# Altium project TARS-Base.PrjPcb
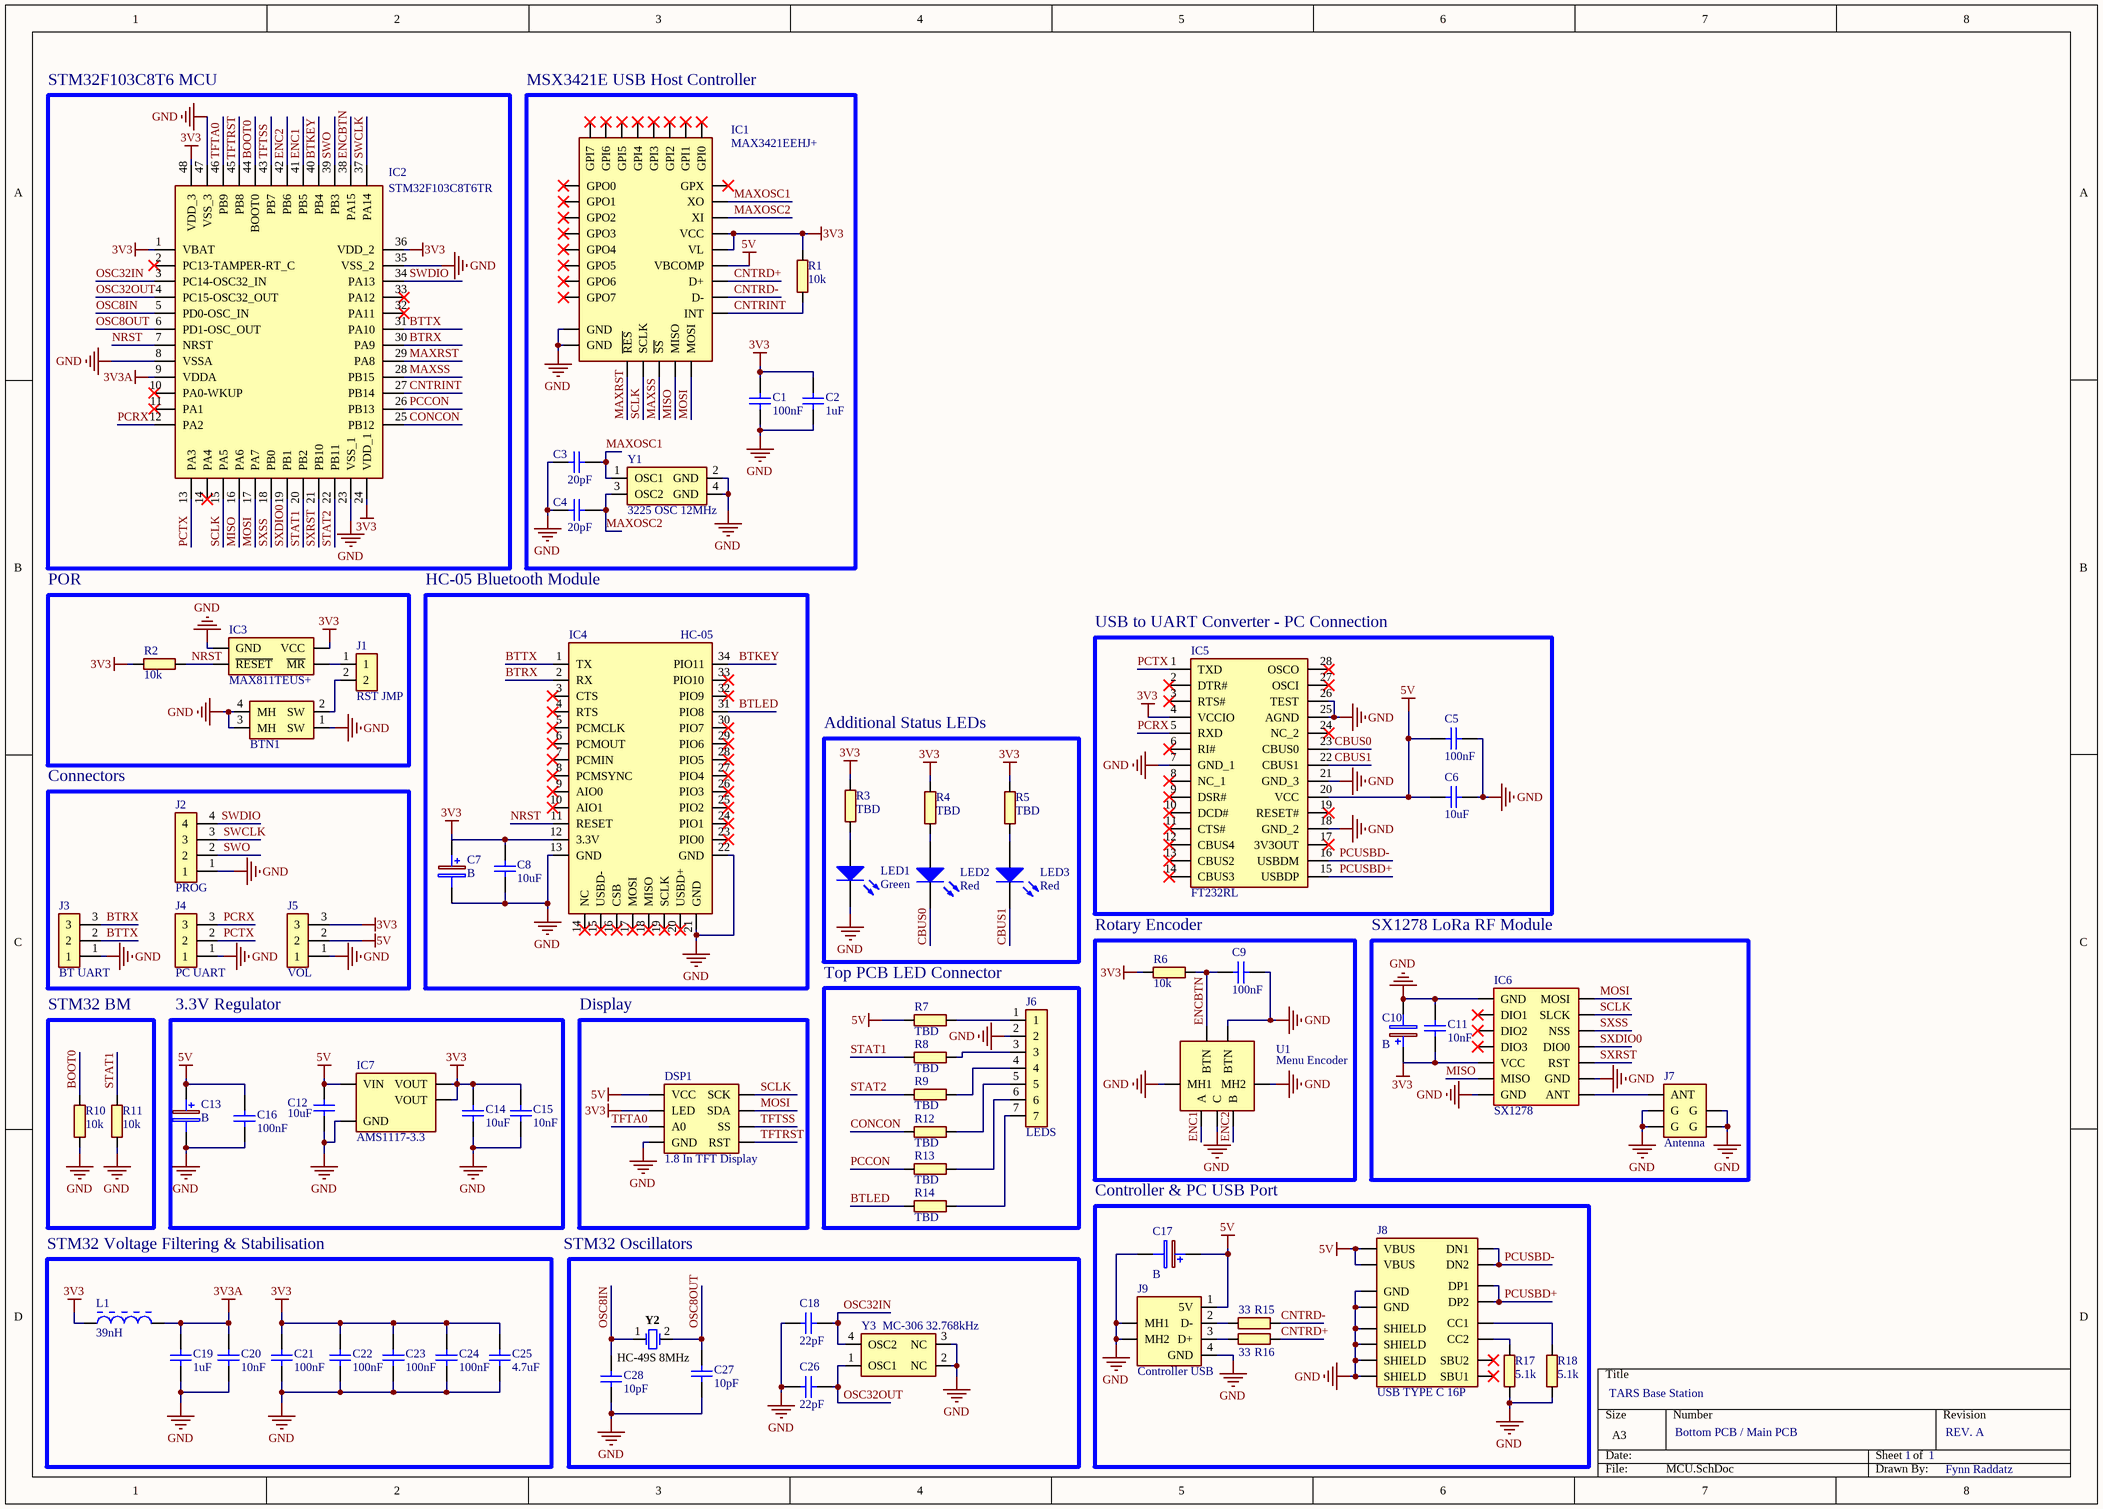
[diagram p0: MCU.SchDoc]
1 sheet, 72 parts. Net scope: global (net labels, ports and power ports of the same name join across sheets).
Board file: PCB1.PcbDoc

## Sheet MCU.SchDoc
size A3; SheetNumber: 1; SheetTotal: 1

### Parts
BTN1  SMD Button 6x6mm Angled  [SMD Button 6x6 Angled]  (value not drawn)
C1  100nF  [CAPC2012 METRIC]
C2  1uF  [CAPC2012 METRIC]
C3  20pF  [CAPC2012 METRIC]
C4  20pF  [CAPC2012 METRIC]
C5  100nF  [CAPC2012 METRIC]
C6  10uF  [CAPC2012 METRIC]
C7  B  [Tantal-B-1210]
C8  10uF  [CAPC2012 METRIC]
C9  100nF  [CAPC2012 METRIC]
C10  B  [Tantal-B-1210]
C11  10nF  [CAPC2012 METRIC]
C12  10uF  [CAPC2012 METRIC]
C13  B  [Tantal-B-1210]
C14  10uF  [CAPC2012 METRIC]
C15  10nF  [CAPC2012 METRIC]
C16  100nF  [CAPC2012 METRIC]
C17  B  [Tantal-B-1210]
C18  22pF  [CAPC2012 METRIC]
C19  1uF  [CAPC2012 METRIC]
C20  10nF  [CAPC2012 METRIC]
C21  100nF  [CAPC2012 METRIC]
C22  100nF  [CAPC2012 METRIC]
C23  100nF  [CAPC2012 METRIC]
C24  100nF  [CAPC2012 METRIC]
C25  4.7uF  [CAPC2012 METRIC]
C26  22pF  [CAPC2012 METRIC]
C27  10pF  [CAPC2012 METRIC]
C28  10pF  [CAPC2012 METRIC]
DSP1  1.8 In TFT Display  [1.8 Inch TFT Display]
IC1  MAX3421EEHJ+  [QFP50P700X700X120-32N]
IC2  STM32F103C8T6TR  [QFP50P900X900X160-48N]
IC3  MAX811TEUS+  [MAX811REUST]
IC4  HC-05  [HC-05]
IC5  FT232RL  [SOP65P778X200-28N]
IC6  SX1278  [SX1278]
IC7  AMS1117-3.3  [SOT229P700X180-4N]
J1  RST JMP  [HDRV2W110P0X254_1X2_508X254X854P]
J2  PROG  [HDRV4W95P0X254_1X4_1016X254X854P]
J3  BT UART  [HDRV3W64P0X254_1X3_762X254X869P]
J4  PC UART  [HDRV3W64P0X254_1X3_762X254X869P]
J5  VOL  [HDRV3W64P0X254_1X3_762X254X869P]
J6  LEDS  [HDRV7W64P0X254_1X7_1778X254X869P]
J7  Antenna  [PCBRPSMAFRAHT]
J8  USB TYPE C 16P  [USB TYPE C 16P]
J9  Controller USB  [875200010BLF]
L1  39nH  [LIRD-LI0805H151R-10-2_V]
LED1  Green  [1206_A]
LED2  Red  [1206_A]
LED3  Red  [1206_A]
R1  10k  [RESC2012X65N]
R2  10k  [RESC2012X65N]
R3  TBD  [RESC2012X65N]
R4  TBD  [RESC2012X65N]
R5  TBD  [RESC2012X65N]
R6  10k  [RESC2012X65N]
R7  TBD  [RESC2012X65N]
R8  TBD  [RESC2012X65N]
R9  TBD  [RESC2012X65N]
R10  10k  [RESC2012X65N]
R11  10k  [RESC2012X65N]
R12  TBD  [RESC2012X65N]
R13  TBD  [RESC2012X65N]
R14  TBD  [RESC2012X65N]
R15  33  [RESC2012X65N]
R16  33  [RESC2012X65N]
R17  5.1k  [RESC2012X65N]
R18  5.1k  [RESC2012X65N]
U1  Menu Encoder  [EC11B152442D]
Y1  3225 OSC 12MHz  [TSX3225240000MF20GAC0]
Y2  HC-49S 8MHz  [FOX-HC49SDLF_V]
Y3  MC-306 32.768kHz  [MC306327680KA3ROHS]

### Blocks framed on the sheet
STM32F103C8T6 MCU: IC2
MSX3421E USB Host Controller: C1-C4 IC1 R1 Y1
POR: BTN1 IC3 J1 R2
HC-05 Bluetooth Module: C7 C8 IC4
USB to UART Converter - PC Connection: C5 C6 IC5
Additional Status LEDs: LED1-LED3 R3-R5
Connectors: J2-J5
Top PCB LED Connector: J6 R7-R9 R12-R14
Rotary Encoder: C9 R6 U1
SX1278 LoRa RF Module: C10 C11 IC6 J7
STM32 BM: R10 R11
3.3V Regulator: C12-C16 IC7
Display: DSP1
Controller & PC USB Port: C17 J8 J9 R15-R18
STM32 Voltage Filtering & Stabilisation: C19-C25 L1

### Nets
3V3: C1.1 C2.1 C7.1(+) C8.1 C10.1(+) C11.2 C14.1 C15.1 C21.2 C22.2 C23.2 C24.2 C25.2 DSP1.1(LED) IC1.2(VL) IC1.23(VCC) IC2.1(VBAT) IC2.24(VDD_1) IC2.36(VDD_2) IC2.48(VDD_3) IC3.4(VCC) IC4.12(3.3V) IC5.4(VCCIO) IC6.5(VCC) IC7.2(VOUT) IC7.4(VOUT) J5.3 L1.1 R1.2 R2.2 R3.2 R4.2 R5.2 R6.2
3V3A: C19.2 C20.2 IC2.9(VDDA) L1.2
5V: C5.1 C6.1 C12.1 C13.1(+) C16.2 C17.1(+) DSP1.8(VCC) IC1.22(VBCOMP) IC5.20(VCC) IC7.3(VIN) J5.2 J8.A4B9(VBUS) J8.B4A9(VBUS) J9.1(5V) R7.2
GND: BTN1.1(SW) BTN1.3(MH) BTN1.4(MH) C1.2 C2.2 C3.2 C4.2 C5.2 C6.2 C7.2(-) C8.2 C9.2 C10.2(-) C11.1 C12.2 C13.2(-) C14.2 C15.2 C16.1 C17.2(-) C18.2 C19.1 C20.1 C21.1 C22.1 C23.1 C24.1 C25.1 C26.2 C27.1 C28.1 DSP1.7(GND) IC1.3(GND) IC1.19(GND) IC2.8(VSSA) IC2.23(VSS_1) IC2.35(VSS_2) IC2.47(VSS_3) IC3.1(GND) IC4.13(GND) IC4.21(GND) IC4.22(GND) IC5.7(GND_1) IC5.18(GND_2) IC5.21(GND_3) IC5.25(AGND) IC5.26(TEST) IC6.1(GND) IC6.12(GND) IC6.14(GND) IC7.1(GND) J2.1 J3.1 J4.1 J5.1 J6.2 J7.2(G) J7.3(G) J7.4(G) J7.5(G) J8.A1B12(GND) J8.B1A12(GND) J8.S1(SHIELD) J8.S2(SHIELD) J8.S3(SHIELD) J8.S4(SHIELD) J9.4(GND) J9.MH1 J9.MH2 LED1.1(K) R10.2 R11.2 R17.1 R18.1 U1.C U1.MH1 U1.MH2 U1.MH4(BTN) Y1.2(GND) Y1.4(GND) Y3.2(NC) Y3.3(NC)
BOOT0: IC2.44(BOOT0) R10.1
BTKEY: IC2.40(PB4) IC4.34(PIO11)
BTLED: IC4.31(PIO8) R14.2
BTRX: IC2.30(PA9) IC4.2(RX) J3.3
BTTX: IC2.31(PA10) IC4.1(TX) J3.2
CBUS0: IC5.23(CBUS0) LED2.1(K)
CBUS1: IC5.22(CBUS1) LED3.1(K)
CNTRD+: IC1.21(D+) R16.2
CNTRD-: IC1.20(D-) R15.2
CNTRINT: IC1.18(INT) IC2.27(PB14) R1.1
CONCON: IC2.25(PB12) R12.2
ENC1: IC2.41(PB5) U1.A
ENC2: IC2.42(PB6) U1.B
ENCBTN: C9.1 IC2.38(PA15) R6.1 U1.MH3(BTN)
MAXOSC1: C3.1 IC1.25(XO) Y1.1(OSC1)
MAXOSC2: C4.1 IC1.24(XI) Y1.3(OSC2)
MAXRST: IC1.12(~{RES}) IC2.29(PA8)
MAXSS: IC1.14(~{SS}) IC2.28(PB15)
MISO: IC1.15(MISO) IC2.16(PA6) IC6.6(MISO)
MOSI: DSP1.3(SDA) IC1.16(MOSI) IC2.17(PA7) IC6.7(MOSI)
NRST: IC2.7(NRST) IC3.2(~{RESET}) IC4.11(RESET) R2.1
OSC8IN: C28.2 IC2.5(PD0-OSC_IN) Y2.1
OSC8OUT: C27.2 IC2.6(PD1-OSC_OUT) Y2.2
OSC32IN: C18.1 IC2.3(PC14-OSC32_IN) Y3.4(OSC2)
OSC32OUT: C26.1 IC2.4(PC15-OSC32_OUT) Y3.1(OSC1)
PCCON: IC2.26(PB13) R13.2
PCRX: IC2.12(PA2) IC5.5(RXD) J4.3
PCTX: IC2.13(PA3) IC5.1(TXD) J4.2
PCUSBD+: IC5.15(USBDP) J8.A6(DP1) J8.B6(DP2)
PCUSBD-: IC5.16(USBDM) J8.A7(DN1) J8.B7(DN2)
SCLK: DSP1.2(SCK) IC1.13(SCLK) IC2.15(PA5) IC6.8(SLCK)
STAT1: IC2.20(PB2) R8.2 R11.1
STAT2: IC2.22(PB11) R9.2
SWCLK: IC2.37(PA14) J2.3
SWDIO: IC2.34(PA13) J2.4
SWO: IC2.39(PB3) J2.2
SXDIO0: IC2.19(PB1) IC6.10(DIO0)
SXRST: IC2.21(PB10) IC6.11(RST)
SXSS: IC2.18(PB0) IC6.9(NSS)
TFTA0: DSP1.4(A0) IC2.46(PB9)
TFTRST: DSP1.5(RST) IC2.45(PB8)
TFTSS: DSP1.6(SS) IC2.43(PB7)
NetBTN1_2: BTN1.2(SW) J1.2
NetIC3_3: IC3.3(~{MR}) J1.1
NetIC6_13: IC6.13(ANT) J7.1(ANT)
NetJ6_1: J6.1 R7.1
NetJ6_3: J6.3 R8.1
NetJ6_4: J6.4 R9.1
NetJ6_5: J6.5 R12.1
NetJ6_6: J6.6 R13.1
NetJ6_7: J6.7 R14.1
NetJ8_A5: J8.A5(CC1) R18.2
NetJ8_B5: J8.B5(CC2) R17.2
NetJ9_2: J9.2(D-) R15.1
NetJ9_3: J9.3(D+) R16.1
NetLED1_2: LED1.2(A) R3.1
NetLED2_2: LED2.2(A) R4.1
NetLED3_2: LED3.2(A) R5.1

Not connected (* = marked no-connect by the designer): IC1 1(GPI7)* 4(GPO0)* 5(GPO1)* 6(GPO2)* 7(GPO3)* 8(GPO4)* 9(GPO5)* 10(GPO6)* 11(GPO7)* 17(GPX)* 26(GPI0)* 27(GPI1)* 28(GPI2)* 29(GPI3)* 30(GPI4)* 31(GPI5)* 32(GPI6)*; IC2 2(PC13-TAMPER-RT_C)* 10(PA0-WKUP)* 11(PA1)* 14(PA4)* 32(PA11)* 33(PA12)*; IC4 3(CTS)* 4(RTS)* 5(PCMCLK)* 6(PCMOUT)* 7(PCMIN)* 8(PCMSYNC)* 9(AIO0)* 10(AIO1)* 14(NC)* 15(USBD-)* 16(CSB)* 17(MOSI)* 18(MISO)* 19(SCLK)* 20(USBD+)* 23(PIO0)* 24(PIO1)* 25(PIO2)* 26(PIO3)* 27(PIO4)* 28(PIO5)* 29(PIO6)* 30(PIO7)* 32(PIO9)* 33(PIO10)*; IC5 2(DTR#)* 3(RTS#)* 6(RI#)* 8(NC_1)* 9(DSR#)* 10(DCD#)* 11(CTS#)* 12(CBUS4)* 13(CBUS2)* 14(CBUS3)* 17(3V3OUT)* 19(RESET#)* 24(NC_2)* 27(OSCI)* 28(OSCO)*; IC6 2(DIO1)* 3(DIO2)* 4(DIO3)*; J8 A8(SBU1)* B8(SBU2)*

### Notes on the sheet
- STM32 Oscillators
- TARS Base Station
- Bottom PCB / Main PCB
- REV. A
- Fynn Raddatz

### Library data of the parts
C1-C6 C8 C9 C11 C12 C14-C16 C18-C28 = CL21B104KACNNNC: Capacitor; Manufacturer_Name: Samsung Electro-Mechanics; Datasheet Link: http://www.samsungsem.com/kr/support/product-search/mlcc/__icsFiles/afieldfile/2016/08/18/S_CL21B104KACNNNC.pdf; Height: 0.95mm; Manufacturer_Part_Number: CL21B104KACNNNC; Mouser Part Number: N/A; Mouser Price/Stock: https://www.mouser.co.uk/ProductDetail/Samsung-Electro-Mechanics/CL21B104KACNNNC?qs=yOVawPpwOwnhB47kNbieFw%3D%3D; Arrow Part Number: CL21B104KACNNNC; Arrow Price/Stock: https://www.arrow.com/en/products/cl21b104kacnnnc/samsung-electro-mechanics
C7 C10 C13 C17 = TANTAL-B: Capacitor Tantalum
DSP1 = TFT Display 1.8In SPI: Display
IC1 = MAX3421EEHJ+: Integrated Circuit; Manufacturer_Name: Maxim Integrated; Datasheet Link: https://datasheet.datasheetarchive.com/originals/distributors/Datasheets-DGA2/214598.pdf; Height: 1.2mm; Manufacturer_Part_Number: MAX3421EEHJ+; Mouser Part Number: 700-MAX3421EEHJ; Mouser Price/Stock: https://www.mouser.co.uk/ProductDetail/Maxim-Integrated/MAX3421EEHJ%2b?qs=1THa7WoU59FLwATVjyu%252Brg%3D%3D; Arrow Part Number: MAX3421EEHJ+; Arrow Price/Stock: https://www.arrow.com/en/products/max3421eehj/maxim-integrated?region=nac
IC2 = STM32F103C8T6TR: Integrated Circuit; Manufacturer_Name: STMicroelectronics; Datasheet Link: http://media.digikey.com/pdf/Data%20Sheets/ST%20Microelectronics%20PDFS/STM32F103x8,B.pdf; Height: 1.6mm; Manufacturer_Part_Number: STM32F103C8T6TR; Mouser Part Number: 511-STM32F103C8T6TR; Mouser Price/Stock: https://www.mouser.co.uk/ProductDetail/STMicroelectronics/STM32F103C8T6TR/?qs=5HwTSiuA5HDxFj62n06yag%3D%3D; Arrow Part Number: STM32F103C8T6TR; Arrow Price/Stock: https://www.arrow.com/en/products/stm32f103c8t6tr/stmicroelectronics
IC3 = MAX811TEUS+: Integrated Circuit; Manufacturer_Name: Maxim Integrated; Datasheet Link: https://pdfserv.maximintegrated.com/en/ds/MAX811-MAX812.pdf; Manufacturer_Part_Number: MAX811TEUS+
IC5 = FT232RL: Integrated Circuit; Manufacturer_Name: FTDI Chip; Datasheet Link: http://www.ftdichip.com/Support/Documents/DataSheets/ICs/DS_FT232R.pdf; Height: 2mm; Manufacturer_Part_Number: FT232RL; Arrow Part Number: FT232RL; Arrow Price/Stock: https://www.arrow.com/en/products/ft232rl/ftdi-chip
IC6 = SX1278: RF
IC7 = AMS1117-3.3: Integrated Circuit; Manufacturer_Name: Advanced Monolithic Systems; Datasheet Link: http://www.advanced-monolithic.com/pdf/ds1117.pdf; Height: 1.8mm; Manufacturer_Part_Number: AMS1117-3.3
J1 = 61300211121: Connector; Manufacturer_Name: Wurth Elektronik; Datasheet Link: https://componentsearchengine.com/Datasheets/2/61300211121.pdf; Height: 8.54mm; Manufacturer_Part_Number: 61300211121; Mouser Part Number: 710-61300211121; Mouser Price/Stock: https://www.mouser.co.uk/ProductDetail/Wurth-Elektronik/61300211121/?qs=t4813l51qx%252B1A5GYDQxPlw%3D%3D
J2 = 61300411121: Connector; Manufacturer_Name: Wurth Elektronik; Datasheet Link: http://katalog.we-online.de/em/datasheet/6130xx11121.pdf; Height: 8.54mm; Manufacturer_Part_Number: 61300411121; Mouser Part Number: 710-61300411121; Mouser Price/Stock: https://www.mouser.co.uk/ProductDetail/Wurth-Elektronik/61300411121?qs=PhR8RmCirEYQcLLqXD8rAA%3D%3D
J3-J5 = 61300311121: Connector; Manufacturer_Name: Wurth Elektronik; Datasheet Link: http://katalog.we-online.de/em/datasheet/6130xx11121.pdf; Height: 8.69mm; Manufacturer_Part_Number: 61300311121; Mouser Part Number: 710-61300311121; Mouser Price/Stock: https://www.mouser.co.uk/ProductDetail/Wurth-Elektronik/61300311121/?qs=PhR8RmCirEYxRWFJzNKsUw%3D%3D
J6 = 61300711121: Connector; Manufacturer_Name: Wurth Elektronik; Datasheet Link: http://katalog.we-online.de/em/datasheet/6130xx11121.pdf; Height: 8.69mm; Manufacturer_Part_Number: 61300711121; Mouser Part Number: 710-61300711121; Mouser Price/Stock: https://www.mouser.co.uk/ProductDetail/Wurth-Elektronik/61300711121?qs=PhR8RmCirEa4Kw6rJ18PJA%3D%3D; System: Connector
J7 = PCB.RPSMAFRA.HT: Connector; Manufacturer_Name: Taoglas; Datasheet Link: http://www.taoglas.com/wp-content/uploads/2016/01/PCB.RPSMAFRA.HT_.pdf; Height: 7.4mm; Manufacturer_Part_Number: PCB.RPSMAFRA.HT; Mouser Part Number: 960-PCB.RPSMAFRA.HT; Mouser Price/Stock: https://www.mouser.co.uk/ProductDetail/Taoglas/PCBRPSMAFRAHT/?qs=RuW%2Fu%252BNMQmvVc2WiXpnkVw%3D%3D
J9 = 87520-0010BLF: Connector; Manufacturer_Name: Amphenol; Datasheet Link: https://componentsearchengine.com/Datasheets/1/87520-0010BLF.pdf; Height: 7.8mm; Manufacturer_Part_Number: 87520-0010BLF; Mouser Part Number: 649-87520-0010BLF; Mouser Price/Stock: https://www.mouser.co.uk/ProductDetail/Amphenol-FCI/87520-0010BLF?qs=x6EjVpvqMVP%2F2to87x7cdQ%3D%3D; Arrow Part Number: 87520-0010BLF; Arrow Price/Stock: https://www.arrow.com/en/products/87520-0010blf/amphenol-fci
L1 = CMP-2000-06404-1: Chip Bead, 100 MHz, 5 A, -40 to 125 degC, 2-Pin SMD (0805), RoHS, Tape and Reel; Manufacturer: Laird; DC Resistance (DCR) (Max): 10mOhm; Current Rating (Max): 5A; Kits: 240-2227-ND-KITEMIFERRITEBEADCHIPSMD; Filter Type: Power,SignalLine; Impedance @ Frequency: 80Ohm@100MHz; Online Catalog: HISeries; Other Names: 240-2395-1; Catalog Drawings: (HI,HZ,LI,MI)0805Series_1.10mmMax.Height; Package Version: Rev. D, 08/2013; Number of Lines: 1; Package / Case: 0805(2012Metric); Package URL: http://cdn.lairdtech.com/home/brandworld/files/LI0805H151R-10.pdf; Standard Package: 1; Manufacturer URL: https://www.lairdtech.com/; Ratings: -; Height (Max): 0.043"(1.10mm); Package Description: 2-Pin Surface Mount Device, Body 2 x 1.25 mm; Category: Filters; Series: HI; Packaging: CutTape(CT); Package Reference: LI0805H15R-10-2; Operating Temperature: -40°C~125°C; Datasheet URL: http://cdn.lairdtech.com/home/brandworld/files/HI0805R800R-10.pdf; Size / Dimension: 0.079"Lx0.049"W(2.00mmx1.25mm); Datasheet Version: Rev. E, 08/2013; Mounting Type: SurfaceMount; Family: FerriteBeadsandChips; Mounting Technology: SurfaceMount
LED1-LED3 = CMP-1426-00014-1: SMD mono-color Chip LED, WL-SMCW, Green; Manufacturer: Wuerth Elektronik; PartNumber: 150120GS75000; PackageReference: 1206_A; ComponentLink1Description: Manufacturer URL; ComponentLink2URL: http://katalog.we-online.com/led/datasheet/150120GS75000.pdf; ComponentLink2Description: Datasheet; Color: Green; ComponentLink1URL: http://www.we-online.com
R1-R18 = Res 0805: Resistor; Manufacturer_Name: Stackpole Electronics Inc.; Manufacturer_Part_Number: RMCF0805ZT0R00; Datasheet Link: https://www.seielect.com/Catalog/SEI-RMCF_RMCP.pdf; Height: 0.65mm; Arrow Part Number: RMCF0805ZT0R00; Arrow Price/Stock: https://www.arrow.com/en/products/rmcf0805zt0r00/stackpole-electronics
U1 = EC11B152442D: Encoder; Manufacturer_Name: ALPS; Height: 31mm; Manufacturer_Part_Number: EC11B152442D; Mouser Part Number: N/A; Mouser Price/Stock: https://www.mouser.com/Search/Refine.aspx?Keyword=N%2FA
Y1 = TSX-3225_16.0000MF10U-B0: Crystal or Oscillator; Manufacturer_Name: Epson Timing; Manufacturer_Part_Number: TSX-3225 16.0000MF10U-B0; Datasheet Link: https://support.epson.biz/td/api/doc_check.php?dl=brief_TSX-3225&lang=en; Height: 0.6mm; Mouser Part Number: 732-322516MF10U-B0; Mouser Price/Stock: https://www.mouser.co.uk/ProductDetail/Epson-Timing/TSX-3225-160000MF10U-B0?qs=%252B0hcjpVv37o282i6EmdVvw%3D%3D
Y2 = CMP-2100-03639-1: Resistance Weld Crystal, 8 MHz, +/- 30 ppm, -20 to 70 degC, 2-Pin SMD, RoHS, Tape and Reel; Manufacturer: FOX Electronics; Series Resistance: 80Ohm; Load Capacitance: 20pF; Tolerance: 50ppm; Frequency Tolerance: 30ppm; Datasheet URL: http://www.foxonline.com/pdfs/hc49sdlf.pdf; Package Reference: HC49SDLF; Height: 4.5mm; Mount: SurfaceMount; Packaging: TapeandReel; Length: 11.7mm; Termination: SMD/SMT; Number of Pins: 2; Depth: 5mm; Frequency: 8MHz; Min Operating Temperature: -20degC; Package Quantity: 1000; RoHSCompliant: True; Lead Free: LeadFree; Width: 5mm; Case/Package: SMD/SMT; Manufacturer URL: http://www.foxonline.com/; Max Operating Temperature: 70degC; REACH SVHC: NoSVHC; Datasheet Version: 42064.0; Package Description: 2-Pin Surface Mount Device, Body 5 x 11.7 mm; Frequency Stability: 50ppm; ESR (Equivalent Series Resistance): 80Ohm; Radiation Hardening: No
Y3 = MC-306_32.7680K-A3_ROHS: Crystal or Oscillator; Manufacturer_Name: Epson Timing; Manufacturer_Part_Number: MC-306 32.7680K-A3:ROHS; Datasheet Link: https://componentsearchengine.com/Datasheets/1/MC-306 32.7680K-A3_ROHS.pdf; Height: 2.54mm; Mouser Part Number: 732-MC306-32.7KA3R; Mouser Price/Stock: https://www.mouser.co.uk/ProductDetail/Epson-Timing/MC-306-327680K-A3ROHS/?qs=CU9taR8hkvbxBMNmXnQ1pw%3D%3D